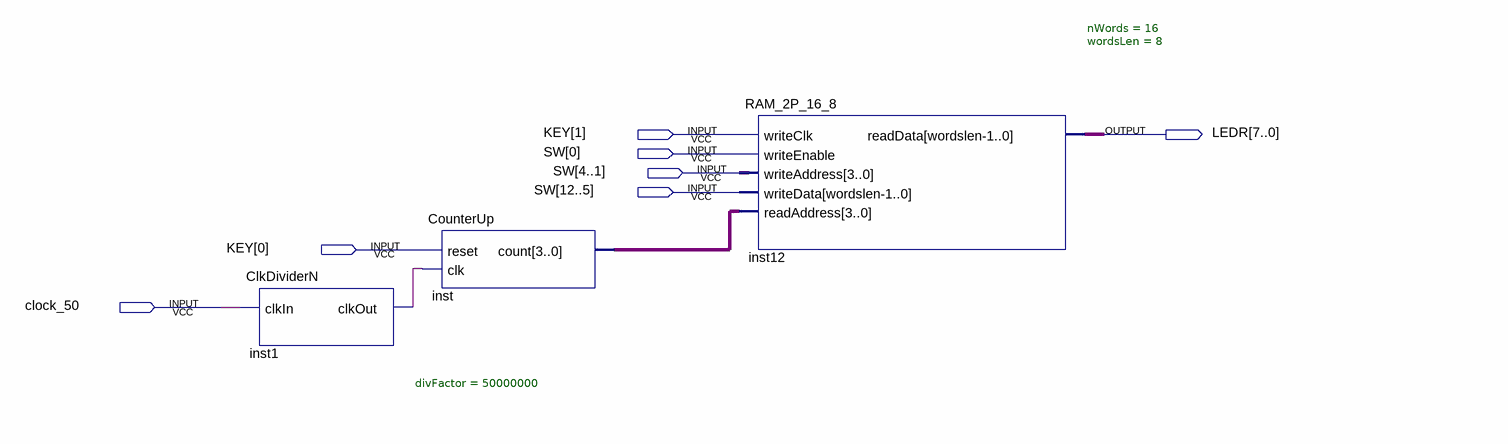
[diagram p0: schematic sheet]
// Quartus schematic RAM_2P_Demo.bdf as structural Verilog: 3 symbols, 7 pins
module RAM_2P_Demo (
  input  [1:0] KEY,
  input  [12:0] SW,
  input  clock_50,
  output [7:0] LEDR
);

  wire inst1_clkout;
  wire [3:0] inst_count;

  ClkDividerN #(.divFactor(50000000)) inst1 (.clkIn(clock_50), .clkOut(inst1_clkout));
  CounterUp inst (.reset(KEY[0]), .clk(inst1_clkout), .count(inst_count));
  RAM_2P_16_8 #(.nWords(16), .wordsLen(8)) inst12 (
    .writeClk(KEY[1]), .writeEnable(SW[0]), .writeAddress(SW[4:1]), .writeData(SW[12:5]),
    .readAddress(inst_count), .readData(LEDR));
endmodule
